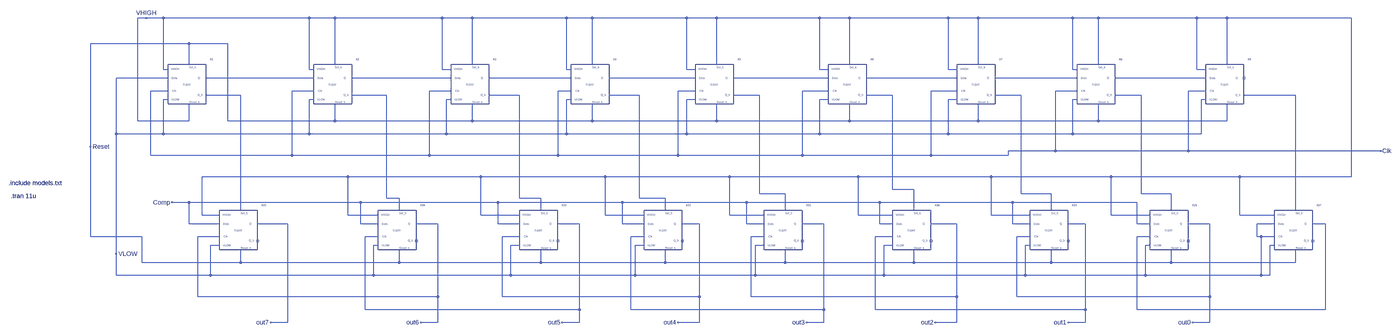
[diagram p0: schematic SAR_logic.asc, whole sheet]
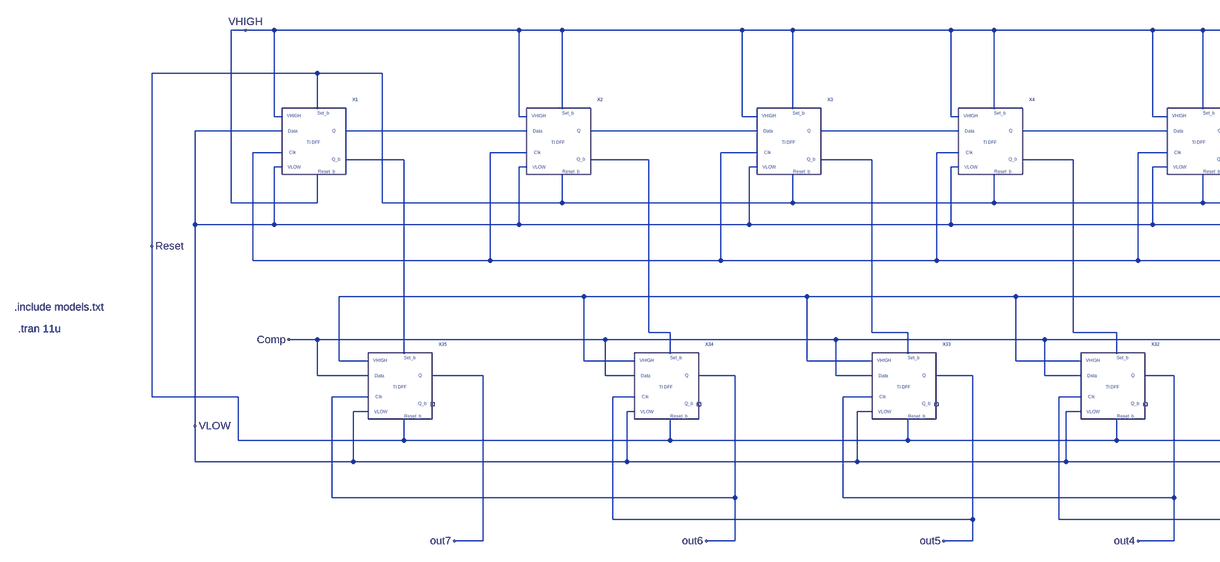
[diagram p1: schematic SAR_logic.asc, part, row 1 of 1, column 1 of 2]
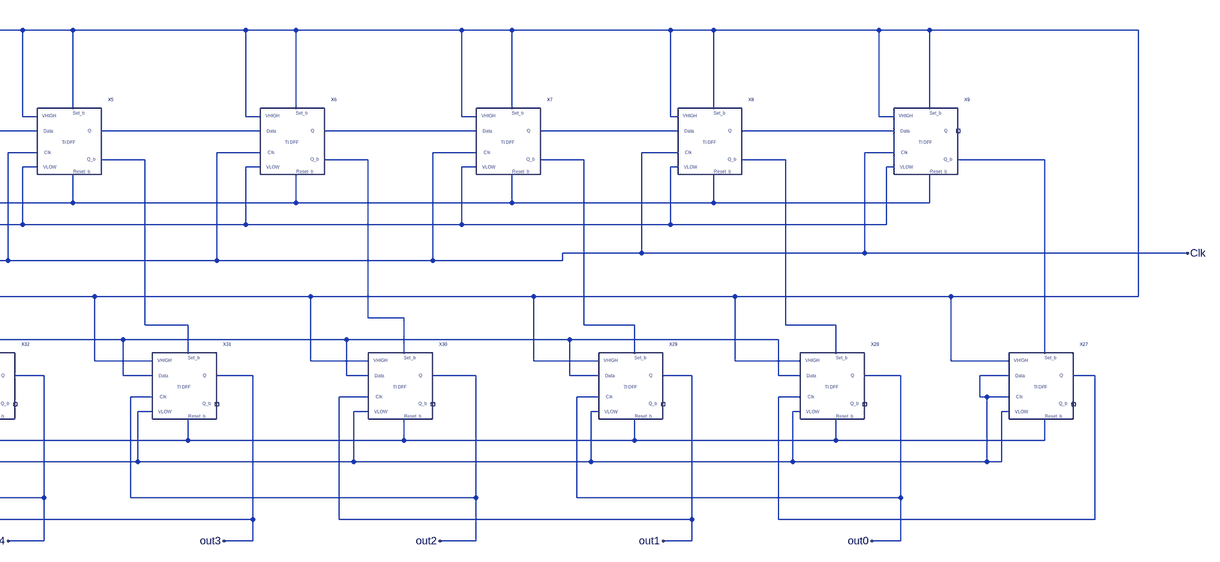
[diagram p2: schematic SAR_logic.asc, part, row 1 of 1, column 2 of 2]
SAR_logic.asc, the LTspice schematic file:
Version 4
SHEET 1 7288 1340
WIRE 1648 144 1616 144
WIRE 1712 144 1648 144
WIRE 2256 144 1712 144
WIRE 2352 144 2256 144
WIRE 2752 144 2352 144
WIRE 2864 144 2752 144
WIRE 3216 144 2864 144
WIRE 3312 144 3216 144
WIRE 3664 144 3312 144
WIRE 3776 144 3664 144
WIRE 4160 144 3776 144
WIRE 4272 144 4160 144
WIRE 4640 144 4272 144
WIRE 4752 144 4640 144
WIRE 5104 144 4752 144
WIRE 5200 144 5104 144
WIRE 5568 144 5200 144
WIRE 5680 144 5568 144
WIRE 6144 144 5680 144
WIRE 1808 240 1440 240
WIRE 1952 240 1808 240
WIRE 1808 320 1808 240
WIRE 2352 320 2352 144
WIRE 2864 320 2864 144
WIRE 3312 320 3312 144
WIRE 3776 320 3776 144
WIRE 4272 320 4272 144
WIRE 4752 320 4752 144
WIRE 5200 320 5200 144
WIRE 5680 320 5680 144
WIRE 1712 336 1712 144
WIRE 1728 336 1712 336
WIRE 2256 336 2256 144
WIRE 2272 336 2256 336
WIRE 2752 336 2752 144
WIRE 2784 336 2752 336
WIRE 3216 336 3216 144
WIRE 3232 336 3216 336
WIRE 3664 336 3664 144
WIRE 3696 336 3664 336
WIRE 4160 336 4160 144
WIRE 4192 336 4160 336
WIRE 4640 336 4640 144
WIRE 4672 336 4640 336
WIRE 5104 336 5104 144
WIRE 5120 336 5104 336
WIRE 5568 336 5568 144
WIRE 5600 336 5568 336
WIRE 1728 368 1536 368
WIRE 2272 368 1872 368
WIRE 2784 368 2416 368
WIRE 3232 368 2928 368
WIRE 3696 368 3376 368
WIRE 4192 368 3840 368
WIRE 4672 368 4336 368
WIRE 5120 368 4816 368
WIRE 5600 368 5264 368
WIRE 1728 416 1664 416
WIRE 2272 416 2192 416
WIRE 2784 416 2704 416
WIRE 3232 416 3184 416
WIRE 3696 416 3632 416
WIRE 4192 416 4096 416
WIRE 4672 416 4576 416
WIRE 5120 416 5040 416
WIRE 5600 416 5536 416
WIRE 2000 432 1872 432
WIRE 2544 432 2416 432
WIRE 3040 432 2928 432
WIRE 3488 432 3376 432
WIRE 3936 432 3840 432
WIRE 4432 432 4336 432
WIRE 4912 432 4816 432
WIRE 5360 432 5264 432
WIRE 5936 432 5744 432
WIRE 1728 448 1712 448
WIRE 2272 448 2256 448
WIRE 2784 448 2768 448
WIRE 3232 448 3216 448
WIRE 3696 448 3664 448
WIRE 4192 448 4160 448
WIRE 4672 448 4640 448
WIRE 5120 448 5104 448
WIRE 5600 448 5584 448
WIRE 1616 528 1616 144
WIRE 1808 528 1808 464
WIRE 1808 528 1616 528
WIRE 1952 528 1952 240
WIRE 2352 528 2352 464
WIRE 2352 528 1952 528
WIRE 2864 528 2864 464
WIRE 2864 528 2352 528
WIRE 3312 528 3312 464
WIRE 3312 528 2864 528
WIRE 3776 528 3776 464
WIRE 3776 528 3312 528
WIRE 4272 528 4272 464
WIRE 4272 528 3776 528
WIRE 4752 528 4752 464
WIRE 4752 528 4272 528
WIRE 5200 528 5200 464
WIRE 5200 528 4752 528
WIRE 5680 528 5680 464
WIRE 5680 528 5200 528
WIRE 1536 576 1536 368
WIRE 1712 576 1712 448
WIRE 1712 576 1536 576
WIRE 2256 576 2256 448
WIRE 2256 576 1712 576
WIRE 2768 576 2768 448
WIRE 2768 576 2256 576
WIRE 3216 576 3216 448
WIRE 3216 576 2768 576
WIRE 3664 576 3664 448
WIRE 3664 576 3216 576
WIRE 4160 576 4160 448
WIRE 4160 576 3664 576
WIRE 4640 576 4640 448
WIRE 4640 576 4160 576
WIRE 5104 576 5104 448
WIRE 5104 576 4640 576
WIRE 5584 576 5584 448
WIRE 5584 576 5104 576
WIRE 1440 624 1440 240
WIRE 5040 640 5040 416
WIRE 5040 640 4864 640
WIRE 5536 640 5536 416
WIRE 5536 640 5040 640
WIRE 6272 640 5536 640
WIRE 1664 656 1664 416
WIRE 2192 656 2192 416
WIRE 2192 656 1664 656
WIRE 2704 656 2704 416
WIRE 2704 656 2192 656
WIRE 3184 656 3184 416
WIRE 3184 656 2704 656
WIRE 3632 656 3632 416
WIRE 3632 656 3184 656
WIRE 4096 656 4096 416
WIRE 4096 656 3632 656
WIRE 4576 656 4576 416
WIRE 4576 656 4096 656
WIRE 4864 656 4864 640
WIRE 4864 656 4576 656
WIRE 2400 736 1856 736
WIRE 2896 736 2400 736
WIRE 3360 736 2896 736
WIRE 3824 736 3360 736
WIRE 4304 736 3824 736
WIRE 4800 736 4304 736
WIRE 5248 736 4800 736
WIRE 5728 736 5248 736
WIRE 6144 736 6144 144
WIRE 6144 736 5728 736
WIRE 4432 784 4432 432
WIRE 4512 784 4432 784
WIRE 3936 800 3936 432
WIRE 4032 800 3936 800
WIRE 4912 800 4912 432
WIRE 5024 800 4912 800
WIRE 5360 800 5360 432
WIRE 5472 800 5360 800
WIRE 2544 816 2544 432
WIRE 2592 816 2544 816
WIRE 3040 816 3040 432
WIRE 3120 816 3040 816
WIRE 3488 816 3488 432
WIRE 3584 816 3488 816
WIRE 1808 832 1744 832
WIRE 2448 832 1808 832
WIRE 2960 832 2448 832
WIRE 3424 832 2960 832
WIRE 3888 832 3424 832
WIRE 4384 832 3888 832
WIRE 4880 832 4384 832
WIRE 5344 832 4880 832
WIRE 2000 864 2000 432
WIRE 2592 864 2592 816
WIRE 3120 864 3120 816
WIRE 3584 864 3584 816
WIRE 4032 864 4032 800
WIRE 4512 864 4512 784
WIRE 5024 864 5024 800
WIRE 5472 864 5472 800
WIRE 5936 864 5936 432
WIRE 1856 880 1856 736
WIRE 1920 880 1856 880
WIRE 2400 880 2400 736
WIRE 2512 880 2400 880
WIRE 2896 880 2896 736
WIRE 3040 880 2896 880
WIRE 3360 880 3360 736
WIRE 3504 880 3360 880
WIRE 3824 880 3824 736
WIRE 3952 880 3824 880
WIRE 4304 880 4304 736
WIRE 4432 880 4304 880
WIRE 4800 880 4800 736
WIRE 4944 880 4800 880
WIRE 5248 880 5248 736
WIRE 5392 880 5248 880
WIRE 5728 880 5728 736
WIRE 5856 880 5728 880
WIRE 1808 912 1808 832
WIRE 1920 912 1808 912
WIRE 2176 912 2064 912
WIRE 2448 912 2448 832
WIRE 2512 912 2448 912
WIRE 2736 912 2656 912
WIRE 2960 912 2960 832
WIRE 3040 912 2960 912
WIRE 3264 912 3184 912
WIRE 3424 912 3424 832
WIRE 3504 912 3424 912
WIRE 3712 912 3648 912
WIRE 3888 912 3888 832
WIRE 3952 912 3888 912
WIRE 4176 912 4096 912
WIRE 4384 912 4384 832
WIRE 4432 912 4384 912
WIRE 4672 912 4576 912
WIRE 4880 912 4880 832
WIRE 4944 912 4880 912
WIRE 5152 912 5088 912
WIRE 5344 912 5344 832
WIRE 5392 912 5344 912
WIRE 5616 912 5536 912
WIRE 5856 912 5792 912
WIRE 6048 912 6000 912
WIRE 1440 960 1440 624
WIRE 1632 960 1440 960
WIRE 1920 960 1840 960
WIRE 2512 960 2464 960
WIRE 3040 960 2976 960
WIRE 3504 960 3456 960
WIRE 3952 960 3904 960
WIRE 4432 960 4368 960
WIRE 4944 960 4896 960
WIRE 5392 960 5344 960
WIRE 5792 960 5792 912
WIRE 5808 960 5792 960
WIRE 5856 960 5808 960
WIRE 1920 992 1888 992
WIRE 2512 992 2496 992
WIRE 3040 992 3008 992
WIRE 3504 992 3472 992
WIRE 3952 992 3920 992
WIRE 4432 992 4400 992
WIRE 4944 992 4928 992
WIRE 5392 992 5376 992
WIRE 5856 992 5840 992
WIRE 1536 1024 1536 576
WIRE 1632 1056 1632 960
WIRE 2000 1056 2000 1008
WIRE 2000 1056 1632 1056
WIRE 2592 1056 2592 1008
WIRE 2592 1056 2000 1056
WIRE 3120 1056 3120 1008
WIRE 3120 1056 2592 1056
WIRE 3584 1056 3584 1008
WIRE 3584 1056 3120 1056
WIRE 4032 1056 4032 1008
WIRE 4032 1056 3584 1056
WIRE 4512 1056 4512 1008
WIRE 4512 1056 4032 1056
WIRE 5024 1056 5024 1008
WIRE 5024 1056 4512 1056
WIRE 5472 1056 5472 1008
WIRE 5472 1056 5024 1056
WIRE 5936 1056 5936 1008
WIRE 5936 1056 5472 1056
WIRE 1536 1104 1536 1024
WIRE 1888 1104 1888 992
WIRE 1888 1104 1536 1104
WIRE 2496 1104 2496 992
WIRE 2496 1104 1888 1104
WIRE 3008 1104 3008 992
WIRE 3008 1104 2496 1104
WIRE 3472 1104 3472 992
WIRE 3472 1104 3008 1104
WIRE 3920 1104 3920 992
WIRE 3920 1104 3472 1104
WIRE 4400 1104 4400 992
WIRE 4400 1104 3920 1104
WIRE 4928 1104 4928 992
WIRE 4928 1104 4400 1104
WIRE 5376 1104 5376 992
WIRE 5376 1104 4928 1104
WIRE 5808 1104 5808 960
WIRE 5808 1104 5376 1104
WIRE 5840 1104 5840 992
WIRE 5840 1104 5808 1104
WIRE 1840 1184 1840 960
WIRE 2736 1184 2736 912
WIRE 2736 1184 1840 1184
WIRE 2976 1184 2976 960
WIRE 3712 1184 3712 912
WIRE 3712 1184 2976 1184
WIRE 3904 1184 3904 960
WIRE 4672 1184 4672 912
WIRE 4672 1184 3904 1184
WIRE 4896 1184 4896 960
WIRE 5616 1184 5616 912
WIRE 5616 1184 4896 1184
WIRE 2464 1232 2464 960
WIRE 3264 1232 3264 912
WIRE 3264 1232 2464 1232
WIRE 3456 1232 3456 960
WIRE 4176 1232 4176 912
WIRE 4176 1232 3456 1232
WIRE 4368 1232 4368 960
WIRE 5152 1232 5152 912
WIRE 5152 1232 4368 1232
WIRE 5344 1232 5344 960
WIRE 6048 1232 6048 912
WIRE 6048 1232 5344 1232
WIRE 2176 1280 2176 912
WIRE 2176 1280 2112 1280
WIRE 2736 1280 2736 1184
WIRE 2736 1280 2672 1280
WIRE 3264 1280 3264 1232
WIRE 3264 1280 3200 1280
WIRE 3712 1280 3712 1184
WIRE 3712 1280 3632 1280
WIRE 4176 1280 4176 1232
WIRE 4176 1280 4112 1280
WIRE 4672 1280 4672 1184
WIRE 4672 1280 4592 1280
WIRE 5152 1280 5152 1232
WIRE 5152 1280 5088 1280
WIRE 5616 1280 5616 1184
WIRE 5616 1280 5552 1280
FLAG 5552 1280 out0
FLAG 5088 1280 out1
FLAG 4592 1280 out2
FLAG 4112 1280 out3
FLAG 3632 1280 out4
FLAG 3200 1280 out5
FLAG 2672 1280 out6
FLAG 2112 1280 out7
FLAG 1536 1024 VLOW
FLAG 6272 640 Clk
FLAG 1440 624 Reset
FLAG 1648 144 VHIGH
FLAG 1744 832 Comp
SYMBOL TI_DFF 1792 368 R0
SYMATTR InstName X1
SYMBOL TI_DFF 2336 368 R0
SYMATTR InstName X2
SYMBOL TI_DFF 2848 368 R0
SYMATTR InstName X3
SYMBOL TI_DFF 3296 368 R0
SYMATTR InstName X4
SYMBOL TI_DFF 3760 368 R0
SYMATTR InstName X5
SYMBOL TI_DFF 4256 368 R0
SYMATTR InstName X6
SYMBOL TI_DFF 4736 368 R0
SYMATTR InstName X7
SYMBOL TI_DFF 5184 368 R0
SYMATTR InstName X8
SYMBOL TI_DFF 5664 368 R0
SYMATTR InstName X9
SYMBOL TI_DFF 5920 912 R0
SYMATTR InstName X27
SYMBOL TI_DFF 5456 912 R0
SYMATTR InstName X28
SYMBOL TI_DFF 5008 912 R0
SYMATTR InstName X29
SYMBOL TI_DFF 4496 912 R0
SYMATTR InstName X30
SYMBOL TI_DFF 4016 912 R0
SYMATTR InstName X31
SYMBOL TI_DFF 3568 912 R0
SYMATTR InstName X32
SYMBOL TI_DFF 3104 912 R0
SYMATTR InstName X33
SYMBOL TI_DFF 2576 912 R0
SYMATTR InstName X34
SYMBOL TI_DFF 1984 912 R0
SYMATTR InstName X35
TEXT 696 760 Left 2 !.include models.txt
TEXT 704 808 Left 2 !.tran 11u

The netlist it stands for:
* SAR_logic.asc
XX1 VHIGH VLOW Clk VLOW Reset VHIGH N001 N009 TI_DFF  ; pins VHIGH VLOW Clk Data Set_b Reset_b Q NOTQ
XX2 VHIGH VLOW Clk N001 VHIGH Reset N002 N010 TI_DFF  ; pins VHIGH VLOW Clk Data Set_b Reset_b Q NOTQ
XX3 VHIGH VLOW Clk N002 VHIGH Reset N003 N011 TI_DFF  ; pins VHIGH VLOW Clk Data Set_b Reset_b Q NOTQ
XX4 VHIGH VLOW Clk N003 VHIGH Reset N004 N012 TI_DFF  ; pins VHIGH VLOW Clk Data Set_b Reset_b Q NOTQ
XX5 VHIGH VLOW Clk N004 VHIGH Reset N005 N013 TI_DFF  ; pins VHIGH VLOW Clk Data Set_b Reset_b Q NOTQ
XX6 VHIGH VLOW Clk N005 VHIGH Reset N006 N014 TI_DFF  ; pins VHIGH VLOW Clk Data Set_b Reset_b Q NOTQ
XX7 VHIGH VLOW Clk N006 VHIGH Reset N007 N015 TI_DFF  ; pins VHIGH VLOW Clk Data Set_b Reset_b Q NOTQ
XX8 VHIGH VLOW Clk N007 VHIGH Reset N008 N016 TI_DFF  ; pins VHIGH VLOW Clk Data Set_b Reset_b Q NOTQ
XX9 VHIGH VLOW Clk N008 VHIGH Reset NC_01 N017 TI_DFF  ; pins VHIGH VLOW Clk Data Set_b Reset_b Q NOTQ
XX27 VHIGH VLOW VLOW VLOW N017 Reset N018 NC_02 TI_DFF  ; pins VHIGH VLOW Clk Data Set_b Reset_b Q NOTQ
XX28 VHIGH VLOW N018 Comp N016 Reset out0 NC_03 TI_DFF  ; pins VHIGH VLOW Clk Data Set_b Reset_b Q NOTQ
XX29 VHIGH VLOW out0 Comp N015 Reset out1 NC_04 TI_DFF  ; pins VHIGH VLOW Clk Data Set_b Reset_b Q NOTQ
XX30 VHIGH VLOW out1 Comp N014 Reset out2 NC_05 TI_DFF  ; pins VHIGH VLOW Clk Data Set_b Reset_b Q NOTQ
XX31 VHIGH VLOW out2 Comp N013 Reset out3 NC_06 TI_DFF  ; pins VHIGH VLOW Clk Data Set_b Reset_b Q NOTQ
XX32 VHIGH VLOW out3 Comp N012 Reset out4 NC_07 TI_DFF  ; pins VHIGH VLOW Clk Data Set_b Reset_b Q NOTQ
XX33 VHIGH VLOW out4 Comp N011 Reset out5 NC_08 TI_DFF  ; pins VHIGH VLOW Clk Data Set_b Reset_b Q NOTQ
XX34 VHIGH VLOW out5 Comp N010 Reset out6 NC_09 TI_DFF  ; pins VHIGH VLOW Clk Data Set_b Reset_b Q NOTQ
XX35 VHIGH VLOW out6 Comp N009 Reset out7 NC_10 TI_DFF  ; pins VHIGH VLOW Clk Data Set_b Reset_b Q NOTQ
.include models.txt
.tran 11u
.backanno
.end